# EAGLE design tides_v40 (EAGLE 9.7.0)

## Sheet 1 of 3
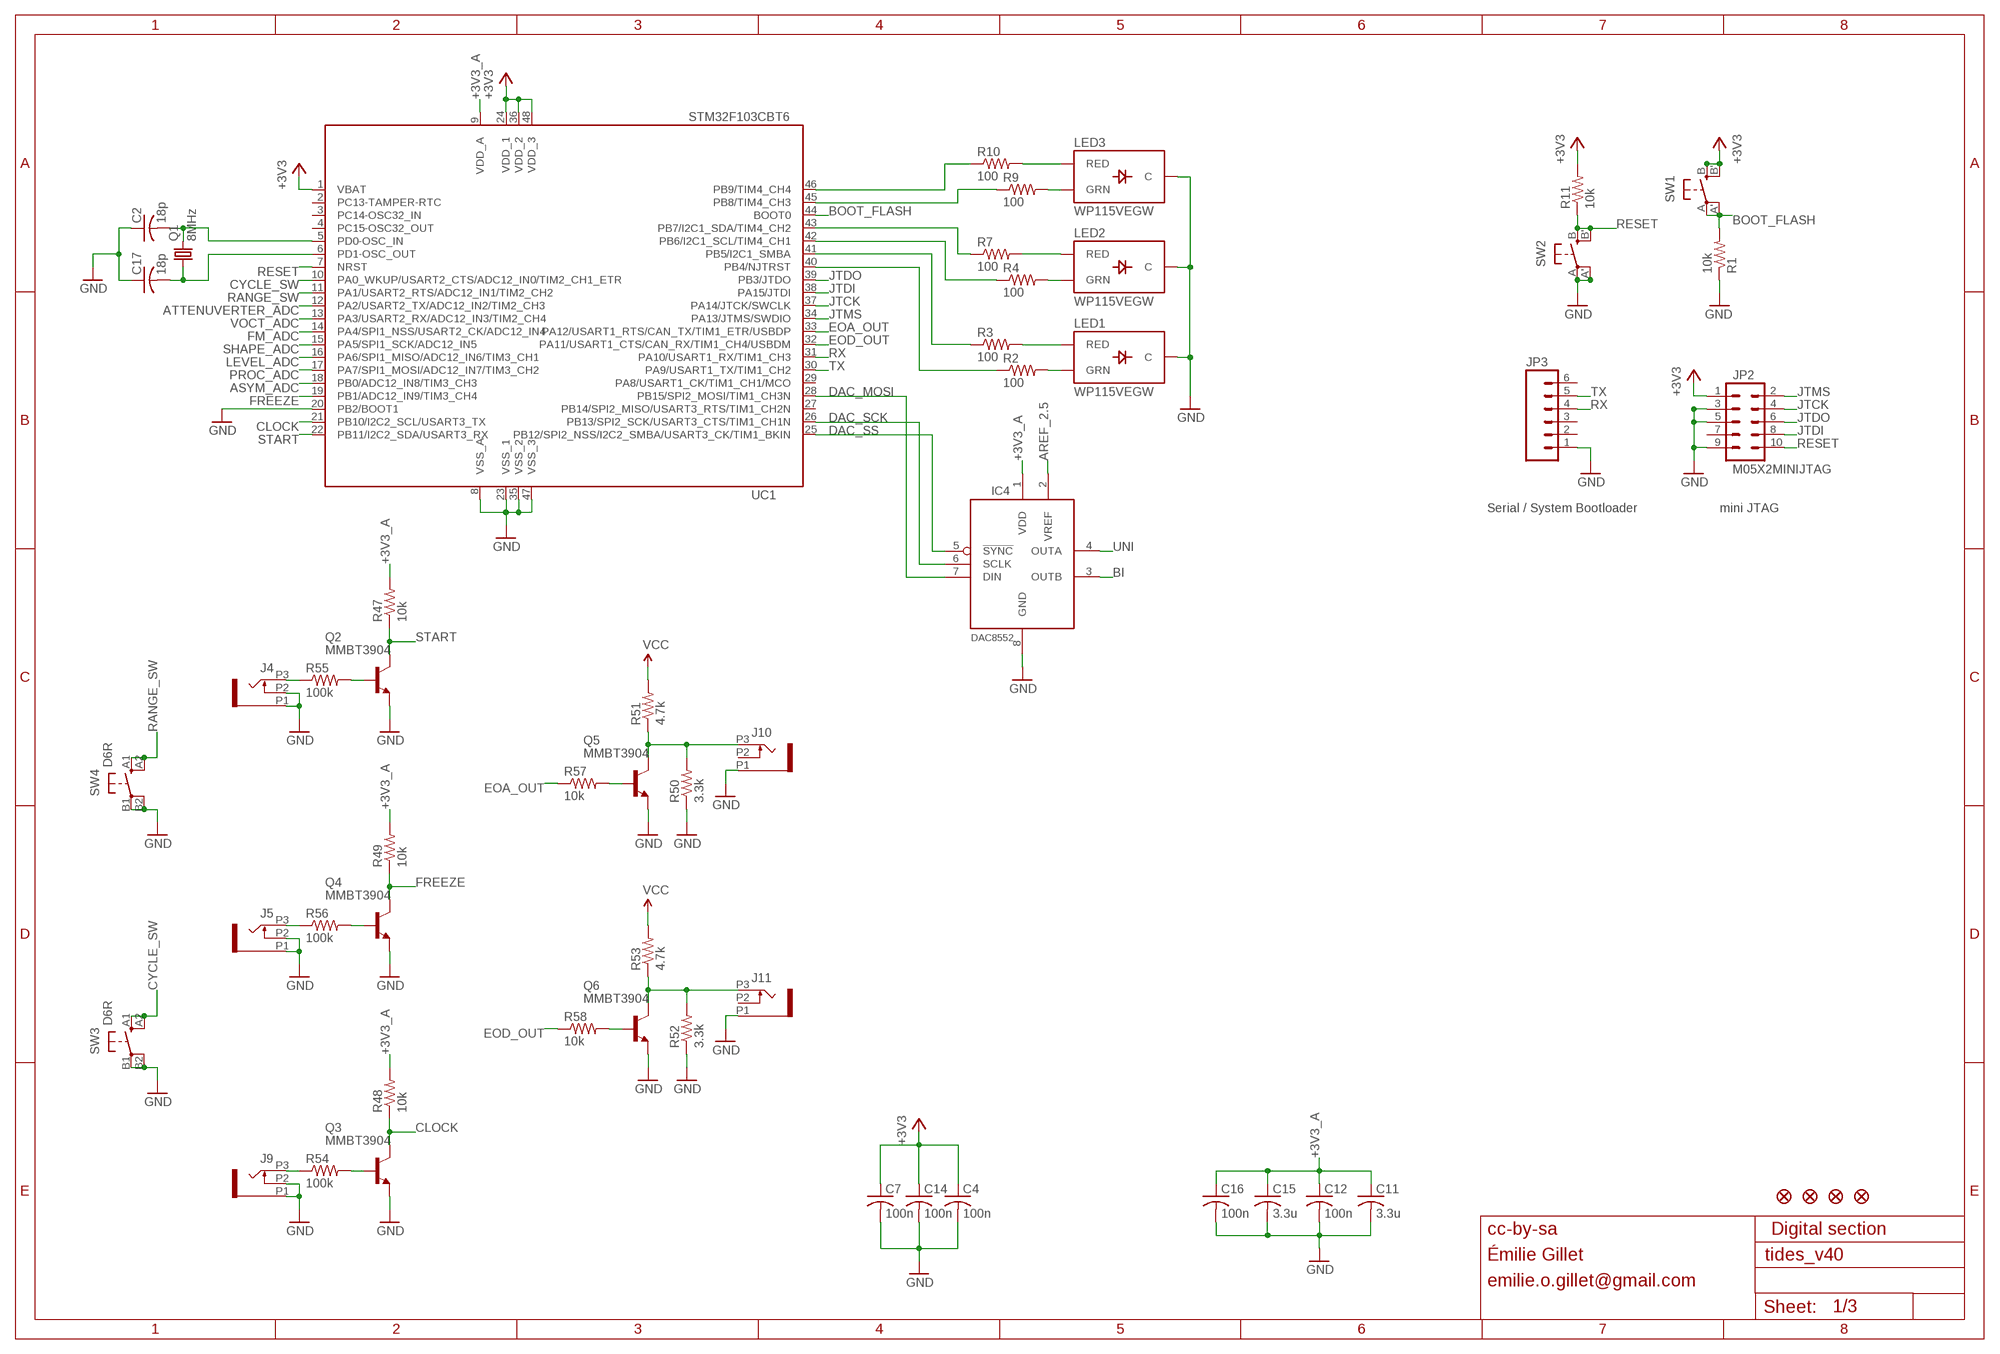
[diagram p0: schematic, sheet 1]

### Parts
C2  18p  C-USC0603  [C0603]
C4  100n  C-USC0603  [C0603]
C7  100n  C-USC0603  [C0603]
C11  3.3u  C-USC0603  [C0603]
C12  100n  C-USC0603  [C0603]
C14  100n  C-USC0603  [C0603]
C15  3.3u  C-USC0603  [C0603]
C16  100n  C-USC0603  [C0603]
C17  18p  C-USC0603  [C0603]
IC4  DAC8552  [MSOP-8]
J4  PJ301_THONKICONN6  [WQP_PJ_301M6]
J5  PJ301_THONKICONN6  [WQP_PJ_301M6]
J9  PJ301_THONKICONN6  [WQP_PJ_301M6]
J10  PJ301_THONKICONN6  [WQP_PJ_301M6]
J11  PJ301_THONKICONN6  [WQP_PJ_301M6]
JP2  M05X2MINIJTAG  [2X5-1.27]
JP3  M06SIP  [1X06]
JP4  FIDUCIAL1X2  [FIDUCIAL-1X2]
JP5  FIDUCIAL1X2  [FIDUCIAL-1X2]
JP6  FIDUCIAL1X2  [FIDUCIAL-1X2]
JP7  FIDUCIAL1X2  [FIDUCIAL-1X2]
LED1  WP115VEGW  LED-BICOLOR-THROUGHHOLE  [LED-BICOLOR-THROUGHHOLE]
LED2  WP115VEGW  LED-BICOLOR-THROUGHHOLE  [LED-BICOLOR-THROUGHHOLE]
LED3  WP115VEGW  LED-BICOLOR-THROUGHHOLE  [LED-BICOLOR-THROUGHHOLE]
Q1  8MHz  CRYSTALHC49UP  [HC49UP]
Q2  MMBT3904  MMBT3904LT1-NPN-SOT23-BEC  [SOT23-BEC]
Q3  MMBT3904  MMBT3904LT1-NPN-SOT23-BEC  [SOT23-BEC]
Q4  MMBT3904  MMBT3904LT1-NPN-SOT23-BEC  [SOT23-BEC]
Q5  MMBT3904  MMBT3904LT1-NPN-SOT23-BEC  [SOT23-BEC]
Q6  MMBT3904  MMBT3904LT1-NPN-SOT23-BEC  [SOT23-BEC]
R1  10k  R-US_R0603  [R0603]
R2  100  R-US_R0603  [R0603]
R3  100  R-US_R0603  [R0603]
R4  100  R-US_R0603  [R0603]
R7  100  R-US_R0603  [R0603]
R9  100  R-US_R0603  [R0603]
R10  100  R-US_R0603  [R0603]
R11  10k  R-US_R0603  [R0603]
R47  10k  R-US_R0603  [R0603]
R48  10k  R-US_R0603  [R0603]
R49  10k  R-US_R0603  [R0603]
R50  3.3k  R-US_R0603  [R0603]
R51  4.7k  R-US_R0603  [R0603]
R52  3.3k  R-US_R0603  [R0603]
R53  4.7k  R-US_R0603  [R0603]
R54  100k  R-US_R0603  [R0603]
R55  100k  R-US_R0603  [R0603]
R56  100k  R-US_R0603  [R0603]
R57  10k  R-US_R0603  [R0603]
R58  10k  R-US_R0603  [R0603]
SW1  EVQQ2  [EVQ-Q2]
SW2  EVQQ2  [EVQ-Q2]
SW3  D6R  [D6R]
SW4  D6R  [D6R]
UC1  STM32F103CBT6  STM32F103CB  [LQFP48]

### Nets
+3V3: C4.1 C7.1 C14.1 JP2.1 R11.2 SW1.B'(S1) SW1.B(S) UC1.1(VBAT) UC1.24(VDD_1) UC1.36(VDD_2) UC1.48(VDD_3) ; also sheet 3
+3V3_A: C11.1 C12.1 C15.1 C16.1 IC4.1(VDD) R47.2 R48.2 R49.2 UC1.9(VDD_A) ; also sheet 2,3
AREF_2.5: IC4.2(VREF) ; also sheet 3
ASYM_ADC: UC1.18(PB0/ADC12_IN8/TIM3_CH3) ; also sheet 2
ATTENUVERTER_ADC: UC1.12(PA2/USART2_TX/ADC12_IN2/TIM2_CH3) ; also sheet 2
BI: IC4.3(OUTB) ; also sheet 2
BOOT_FLASH: R1.2 SW1.A'(P1) SW1.A(P) UC1.44(BOOT0)
CLOCK: Q3.C R48.1 UC1.21(PB10/I2C2_SCL/USART3_TX)
CYCLE_SW: SW3.A1(S) SW3.A2(S1) UC1.10(PA0_WKUP/USART2_CTS/ADC12_IN0/TIM2_CH1_ETR)
DAC_MOSI: IC4.7(DIN) UC1.28(PB15/SPI2_MOSI/TIM1_CH3N)
DAC_SCK: IC4.6(SCLK) UC1.26(PB13/SPI2_SCK/USART3_CTS/TIM1_CH1N)
DAC_SS: IC4.5(!SYNC) UC1.25(PB12/SPI2_NSS/I2C2_SMBA/USART3_CK/TIM1_BKIN)
EOA_OUT: R57.1 UC1.33(PA12/USART1_RTS/CAN_TX/TIM1_ETR/USBDP)
EOD_OUT: R58.1 UC1.32(PA11/USART1_CTS/CAN_RX/TIM1_CH4/USBDM)
FM_ADC: UC1.14(PA4/SPI1_NSS/USART2_CK/ADC12_IN4) ; also sheet 2
FREEZE: Q4.C R49.1 UC1.19(PB1/ADC12_IN9/TIM3_CH4)
GND: C2.1 C4.2 C7.2 C11.2 C12.2 C14.2 C15.2 C16.2 C17.1 IC4.8(GND) J4.P1 J4.P2 J5.P1 J5.P2 J9.P1 J9.P2 J10.P1 J11.P1 JP2.3 JP2.5 JP2.9 JP3.1 LED1.2(C) LED2.2(C) LED3.2(C) Q2.E Q3.E Q4.E Q5.E Q6.E R1.1 R50.1 R52.1 SW2.A'(P1) SW2.A(P) SW3.B1(P) SW3.B2(P1) SW4.B1(P) SW4.B2(P1) UC1.8(VSS_A) UC1.20(PB2/BOOT1) UC1.23(VSS_1) UC1.35(VSS_2) UC1.47(VSS_3) ; also sheet 2,3
JTCK: JP2.4 UC1.37(PA14/JTCK/SWCLK)
JTDI: JP2.8 UC1.38(PA15/JTDI)
JTDO: JP2.6 UC1.39(PB3/JTDO)
JTMS: JP2.2 UC1.34(PA13/JTMS/SWDIO)
LEVEL_ADC: UC1.16(PA6/SPI1_MISO/ADC12_IN6/TIM3_CH1) ; also sheet 2
N$7: C2.2 Q1.2 UC1.5(PD0-OSC_IN)
N$8: C17.2 Q1.1 UC1.6(PD1-OSC_OUT)
N$21: J5.P3 R56.1
N$23: Q4.B R56.2
N$24: J9.P3 R54.1
N$25: Q3.B R54.2
N$26: Q6.B R58.2
N$27: J11.P3 Q6.C R52.2 R53.1
N$28: LED3.3(RED) R10.2
N$29: LED3.1(GRN) R9.2
N$30: LED2.3(RED) R7.2
N$31: LED2.1(GRN) R4.2
N$32: LED1.3(RED) R3.2
N$33: LED1.1(GRN) R2.2
N$34: R10.1 UC1.46(PB9/TIM4_CH4)
N$35: R9.1 UC1.45(PB8/TIM4_CH3)
N$36: R7.1 UC1.43(PB7/I2C1_SDA/TIM4_CH2)
N$37: R4.1 UC1.42(PB6/I2C1_SCL/TIM4_CH1)
N$38: R3.1 UC1.41(PB5/I2C1_SMBA)
N$39: R2.1 UC1.40(PB4/NJTRST)
N$44: J10.P3 Q5.C R50.2 R51.1
N$47: Q5.B R57.2
N$57: J4.P3 R55.1
N$66: Q2.B R55.2
PROC_ADC: UC1.17(PA7/SPI1_MOSI/ADC12_IN7/TIM3_CH2) ; also sheet 2
RANGE_SW: SW4.A1(S) SW4.A2(S1) UC1.11(PA1/USART2_RTS/ADC12_IN1/TIM2_CH2)
RESET: JP2.10 R11.1 SW2.B'(S1) SW2.B(S) UC1.7(NRST)
RX: JP3.4 UC1.31(PA10/USART1_RX/TIM1_CH3)
SHAPE_ADC: UC1.15(PA5/SPI1_SCK/ADC12_IN5) ; also sheet 2
START: Q2.C R47.1 UC1.22(PB11/I2C2_SDA/USART3_RX)
TX: JP3.5 UC1.30(PA9/USART1_TX/TIM1_CH2)
UNI: IC4.4(OUTA) ; also sheet 2
VCC: R51.2 R53.2 ; also sheet 2,3
VOCT_ADC: UC1.13(PA3/USART2_RX/ADC12_IN3/TIM2_CH4) ; also sheet 2
Unconnected: J10.P2 J11.P2 JP2.7 JP3.2 JP3.3 JP3.6 UC1.2(PC13-TAMPER-RTC) UC1.3(PC14-OSC32_IN) UC1.4(PC15-OSC32_OUT) UC1.27(PB14/SPI2_MISO/USART3_RTS/TIM1_CH2N) UC1.29(PA8/USART1_CK/TIM1_CH1/MCO)

### Notes on the sheet
- Serial / System Bootloader | mini JTAG
- cc-by-sa | Digital section
- Émilie Gillet
- emilie.o.gillet@gmail.com

## Sheet 2 of 3
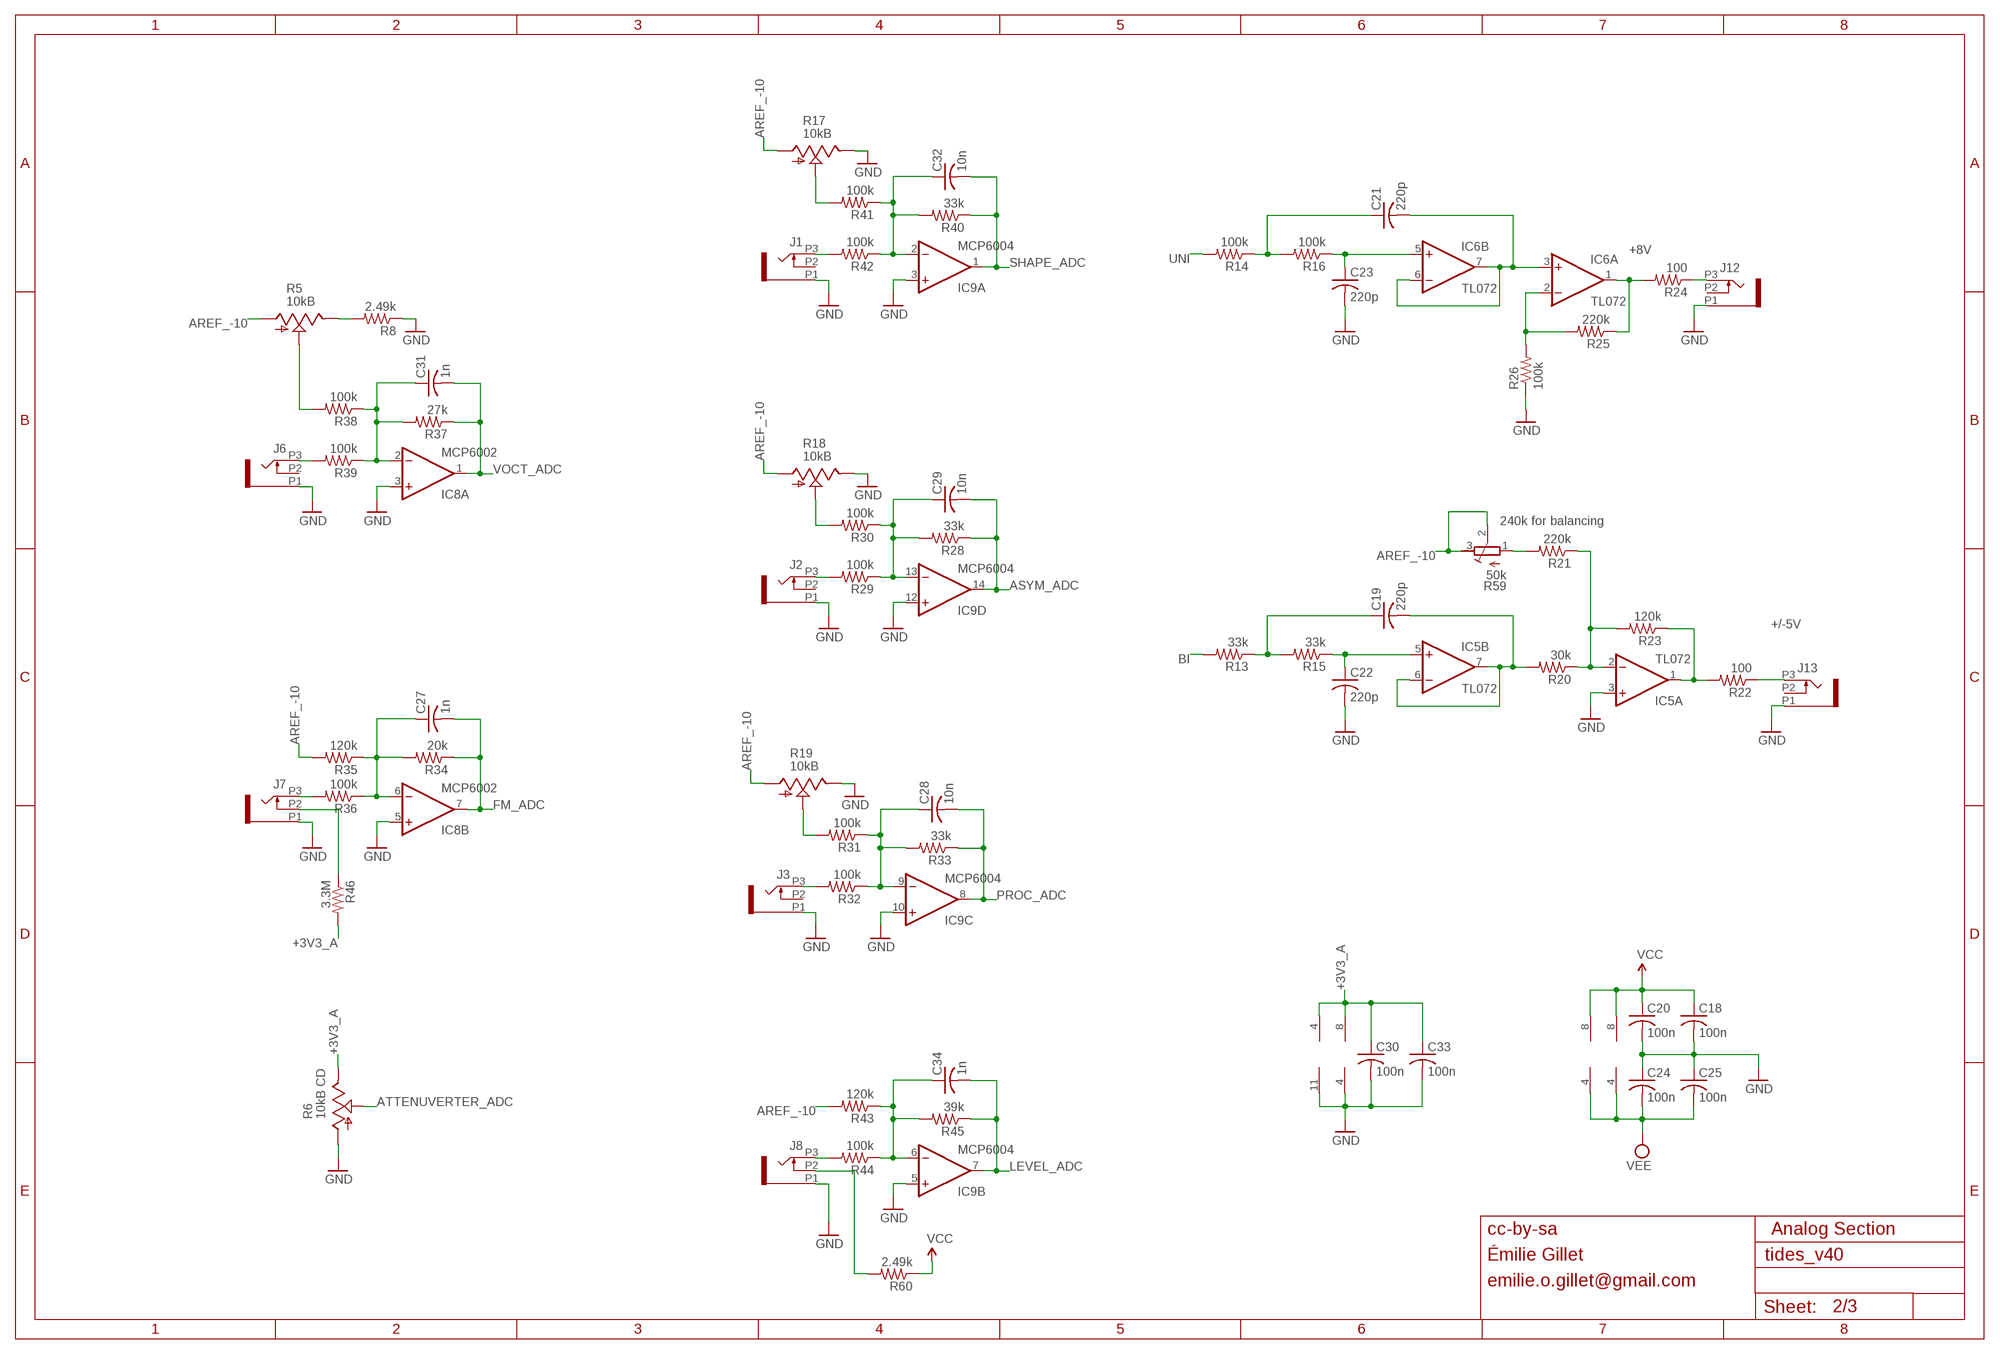
[diagram p1: schematic, sheet 2]

### Parts
C18  100n  C-USC0603  [C0603]
C19  220p  C-USC0603  [C0603]
C20  100n  C-USC0603  [C0603]
C21  220p  C-USC0603  [C0603]
C22  220p  C-USC0603  [C0603]
C23  220p  C-USC0603  [C0603]
C24  100n  C-USC0603  [C0603]
C25  100n  C-USC0603  [C0603]
C27  1n  C-USC0603  [C0603]
C28  10n  C-USC0603  [C0603]
C29  10n  C-USC0603  [C0603]
C30  100n  C-USC0603  [C0603]
C31  1n  C-USC0603  [C0603]
C32  10n  C-USC0603  [C0603]
C33  100n  C-USC0603  [C0603]
C34  1n  C-USC0603  [C0603]
IC5  TL072  TL072D  [SO08]
IC6  TL072  TL072D  [SO08]
IC8  MCP6002  TL072D  [SO08]
IC9  MCP6004  TL074D  [SO14]
J1  PJ301_THONKICONN6  [WQP_PJ_301M6]
J2  PJ301_THONKICONN6  [WQP_PJ_301M6]
J3  PJ301_THONKICONN6  [WQP_PJ_301M6]
J6  PJ301_THONKICONN6  [WQP_PJ_301M6]
J7  PJ301_THONKICONN6  [WQP_PJ_301M6]
J8  PJ301_THONKICONN6  [WQP_PJ_301M6]
J12  PJ301_THONKICONN6  [WQP_PJ_301M6]
J13  PJ301_THONKICONN6  [WQP_PJ_301M6]
R5  10kB  POT_USVERTICAL_PS  [ALPS_POT_VERTICAL_PS]
R6  10kB CD  POT_USVERTICAL_PS  [ALPS_POT_VERTICAL_PS]
R8  2.49k  R-US_R0603  [R0603]
R13  33k  R-US_R0603  [R0603]
R14  100k  R-US_R0603  [R0603]
R15  33k  R-US_R0603  [R0603]
R16  100k  R-US_R0603  [R0603]
R17  10kB  POT_USVERTICAL_PS  [ALPS_POT_VERTICAL_PS]
R18  10kB  POT_USVERTICAL_PS  [ALPS_POT_VERTICAL_PS]
R19  10kB  POT_USVERTICAL_PS  [ALPS_POT_VERTICAL_PS]
R20  30k  R-US_R0603  [R0603]
R21  220k  R-US_R0603  [R0603]
R22  100  R-US_R0603  [R0603]
R23  120k  R-US_R0603  [R0603]
R24  100  R-US_R0603  [R0603]
R25  220k  R-US_R0603  [R0603]
R26  100k  R-US_R0603  [R0603]
R28  33k  R-US_R0603  [R0603]
R29  100k  R-US_R0603  [R0603]
R30  100k  R-US_R0603  [R0603]
R31  100k  R-US_R0603  [R0603]
R32  100k  R-US_R0603  [R0603]
R33  33k  R-US_R0603  [R0603]
R34  20k  R-US_R0603  [R0603]
R35  120k  R-US_R0603  [R0603]
R36  100k  R-US_R0603  [R0603]
R37  27k  R-US_R0603  [R0603]
R38  100k  R-US_R0603  [R0603]
R39  100k  R-US_R0603  [R0603]
R40  33k  R-US_R0603  [R0603]
R41  100k  R-US_R0603  [R0603]
R42  100k  R-US_R0603  [R0603]
R43  120k  R-US_R0603  [R0603]
R44  100k  R-US_R0603  [R0603]
R45  39k  R-US_R0603  [R0603]
R46  3.3M  R-US_R0603  [R0603]
R59  50k  R-TRIMM3296X  [RTRIM3296X]
R60  2.49k  R-US_R0805  [R0805]

### Nets
+3V3_A: C30.1 C33.1 IC8.8(P:V+) IC9.4(P:V+) R6.P$1(E) R46.2 ; also sheet 1,3
AREF_-10: R5.P$3(A) R17.P$3(A) R18.P$3(A) R19.P$3(A) R35.2 R43.2 R59.2(S) R59.3(A) ; also sheet 3
ASYM_ADC: C29.2 IC9.14(D:OUT) R28.1 ; also sheet 1
ATTENUVERTER_ADC: R6.P$2(S) ; also sheet 1
BI: R13.2 ; also sheet 1
BI_OUT: IC5.1(A:OUT) R22.2 R23.1
F_CV: IC5.2(A:-IN) R20.1 R21.1 R23.2
FM_ADC: C27.2 IC8.7(B:OUT) R34.1 ; also sheet 1
GND: C18.2 C20.2 C22.2 C23.2 C24.1 C25.1 C30.2 C33.2 IC5.3(A:+IN) IC8.3(A:+IN) IC8.4(P:V-) IC8.5(B:+IN) IC9.3(A:+IN) IC9.5(B:+IN) IC9.10(C:+IN) IC9.11(P:V-) IC9.12(D:+IN) J1.P1 J2.P1 J3.P1 J6.P1 J7.P1 J8.P1 J12.P1 J13.P1 R6.P$3(A) R8.1 R17.P$1(E) R18.P$1(E) R19.P$1(E) R26.1 ; also sheet 1,3
LEVEL_ADC: C34.2 IC9.7(B:OUT) R45.1 ; also sheet 1
N$1: J1.P3 R42.2
N$2: C32.1 IC9.2(A:-IN) R40.2 R41.1 R42.1
N$3: R17.P$2(S) R41.2
N$4: J2.P3 R29.2
N$5: C29.1 IC9.13(D:-IN) R28.2 R29.1 R30.1
N$6: J7.P2 R46.1
N$9: R18.P$2(S) R30.2
N$10: J3.P3 R32.2
N$11: C28.1 IC9.9(C:-IN) R31.1 R32.1 R33.2
N$12: R19.P$2(S) R31.2
N$13: J8.P3 R44.2
N$14: C34.1 IC9.6(B:-IN) R43.1 R44.1 R45.2
N$15: J6.P3 R39.2
N$16: C31.1 IC8.2(A:-IN) R37.2 R38.1 R39.1
N$17: R5.P$2(S) R38.2
N$18: J13.P3 R22.1
N$19: R5.P$1(E) R8.2
N$20: J7.P3 R36.2
N$22: C27.1 IC8.6(B:-IN) R34.2 R35.1 R36.1
N$40: R21.2 R59.1(E)
N$41: IC6.2(A:-IN) R25.2 R26.2
N$42: C19.2 IC5.6(B:-IN) IC5.7(B:OUT) R20.2
N$43: C22.1 IC5.5(B:+IN) R15.1
N$45: C19.1 R13.1 R15.2
N$46: IC6.1(A:OUT) R24.2 R25.1
N$48: J8.P2 R60.2
N$67: C21.2 IC6.3(A:+IN) IC6.6(B:-IN) IC6.7(B:OUT)
N$69: C23.1 IC6.5(B:+IN) R16.1
N$71: C21.1 R14.1 R16.2
PROC_ADC: C28.2 IC9.8(C:OUT) R33.1 ; also sheet 1
SHAPE_ADC: C32.2 IC9.1(A:OUT) R40.1 ; also sheet 1
UNI: R14.2 ; also sheet 1
UNI_OUT: J12.P3 R24.1
VCC: C18.1 C20.1 IC5.8(P:V+) IC6.8(P:V+) R60.1 ; also sheet 1,3
VEE: C24.2 C25.2 IC5.4(P:V-) IC6.4(P:V-) ; also sheet 3
VOCT_ADC: C31.2 IC8.1(A:OUT) R37.1 ; also sheet 1
Unconnected: J1.P2 J2.P2 J3.P2 J6.P2 J12.P2 J13.P2

### Notes on the sheet
- +8V
- 240k for balancing
- +/-5V
- cc-by-sa | Analog Section
- Émilie Gillet
- emilie.o.gillet@gmail.com

## Sheet 3 of 3
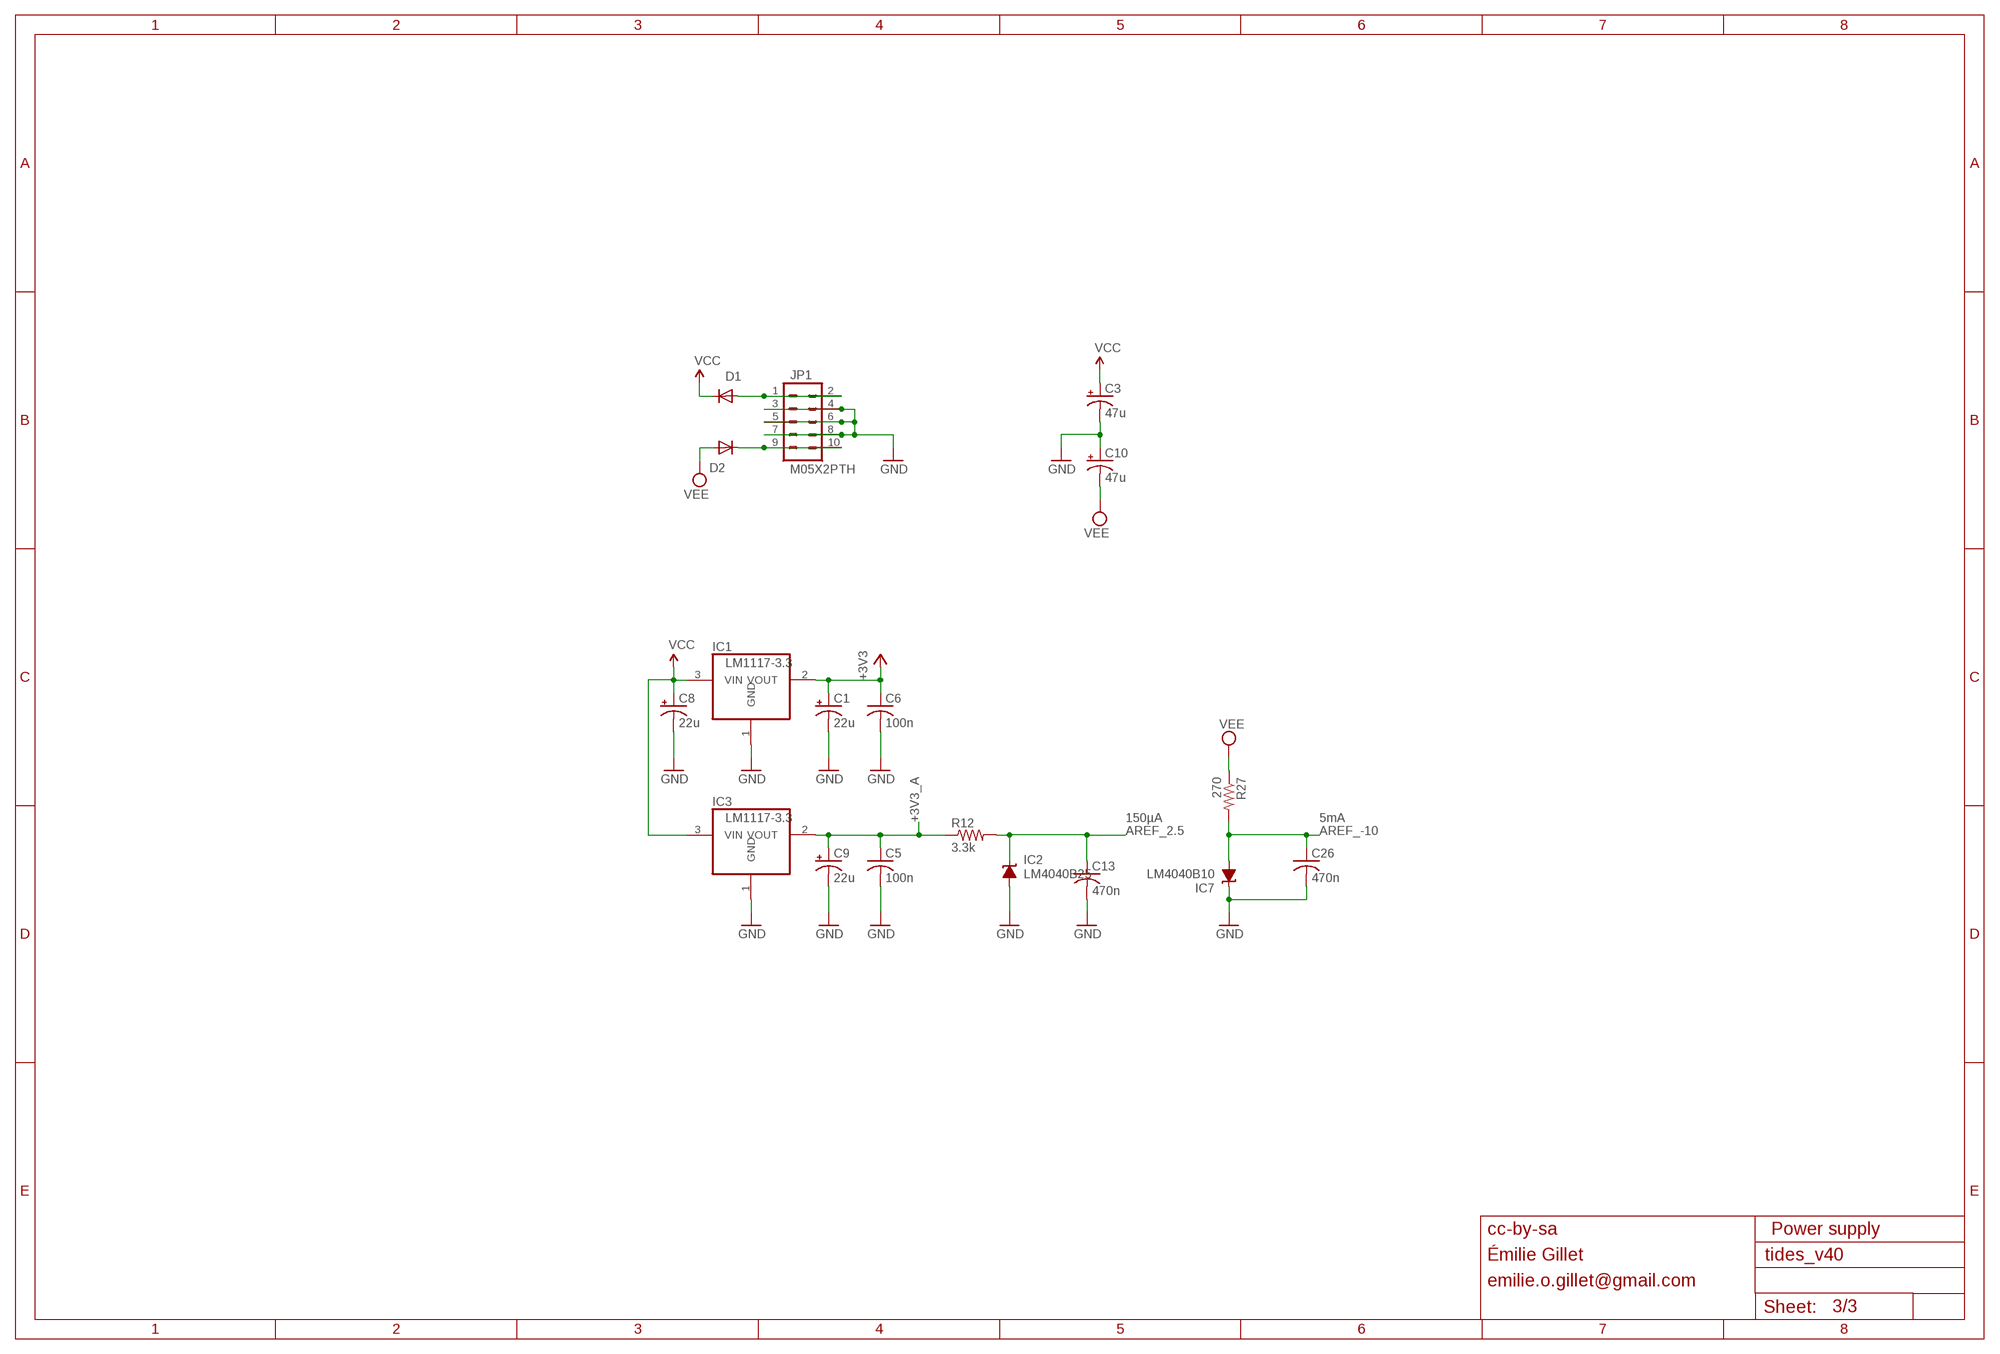
[diagram p2: schematic, sheet 3]

### Parts
C1  22u  CPOL-USC  [PANASONIC_C]
C3  47u  CPOL-USD  [PANASONIC_D]
C5  100n  C-USC0603  [C0603]
C6  100n  C-USC0603  [C0603]
C8  22u  CPOL-USC  [PANASONIC_C]
C9  22u  CPOL-USC  [PANASONIC_C]
C10  47u  CPOL-USD  [PANASONIC_D]
C13  470n  C-USC0603  [C0603]
C26  470n  C-USC0603  [C0603]
D1  1N5819HW  DIODE-SOD123  [SOD123]
D2  1N5819HW  DIODE-SOD123  [SOD123]
IC1  LM1117-3.3  REG1117  [SOT223]
IC2  LM4040B25  LM4041B12DBZ  [DBZ_R-PDSO-G3]
IC3  LM1117-3.3  REG1117  [SOT223]
IC7  LM4040B10  LM4041B12DBZ  [DBZ_R-PDSO-G3]
JP1  M05X2PTH  [AVR_ICSP]
R12  3.3k  R-US_R0603  [R0603]
R27  270  R-US_R0603  [R0603]

### Nets
+3V3: C1.+ C6.1 IC1.2(VOUT) ; also sheet 1
+3V3_A: C5.1 C9.+ IC3.2(VOUT) R12.1 ; also sheet 1,2
AREF_2.5: C13.1 IC2.1(C) R12.2 ; also sheet 1
AREF_-10: C26.1 IC7.2(A) R27.2 ; also sheet 2
GND: C1.- C3.- C5.2 C6.2 C8.- C9.- C10.+ C13.2 C26.2 IC1.1(GND) IC2.2(A) IC3.1(GND) IC7.1(C) JP1.3 JP1.4 JP1.5 JP1.6 JP1.7 JP1.8 ; also sheet 1,2
N$56: D1.A JP1.1 JP1.2
N$64: D2.C JP1.9 JP1.10
VCC: C3.+ C8.+ D1.C IC1.3(VIN) IC3.3(VIN) ; also sheet 1,2
VEE: C10.- D2.A R27.1 ; also sheet 2

### Notes on the sheet
- 150µA | 5mA
- cc-by-sa | Power supply
- Émilie Gillet
- emilie.o.gillet@gmail.com

## Library data of the parts
C1 C3 C8-C10 = rcl:CPOL-US: POLARIZED CAPACITOR, American symbol
C2 C4-C7 C11-C34 = rcl:C-US: CAPACITOR, American symbol
D1 D2 = diode:DIODE-: DIODE
IC1 IC3 = og-vreg:REG1117: 800mA and 1A Low Dropout (LDO) Positive Regulator 1.8V, 2.5V, 2.85V, 3.3V, 5V, and Adj
IC2 IC7 = texas:LM4041: PRECISION MICROPOWER SHUNT VOLTAGE REFERENCE Source: http://focus.ti.com/lit/ds/slcs146e/slcs146e.pdf
IC4 = og-dac:DAC8552
IC5 IC6 IC8 = linear:TL072: OP AMP
IC9 = gm-ics:TL074: OP AMP
J1-J13 = og-pj301_variations:PJ301_THONKICONN
JP1 JP2 = og-header:M05X2: Header 5x2 Standard 10-pin dual row 0.1" header. Commonly used with AVR-ISP. Use with Spark Fun Electronics SKU: PRT-00778
JP3 = SparkFun:M06: Header 6 Standard 6-pin 0.1" header. Use with straight break away headers (SKU : PRT-00116), right angle break away headers (PRT-00553), swiss pins (PRT-00743), machine pins (PRT-00117), and female headers (PRT-00115). Molex polarized connector foot print use with SKU : PRT-08094 with associated crimp pins and housings. NOTES ON THE VARIANTS LOCK and LOCK_LONGPADS... This footprint was designed to help hold the alignment of a through-hole component (i.e. 6-pin header) while soldering it into place. You may notice that each hole has been shifted either up or down by 0.005 of an inch from it's more standard position (which is a perfectly straight line). This slight alteration caused the pins (the squares in the middle) to touch the edges of the holes. Because they are alternating, it causes a "brace" to hold the component in place. 0.005 has proven to be the perfect amount of "off-center" position when using our standard breakaway headers. Although looks a little odd when you look at the bare footprint, once you have a header in there, the alteration is very hard to notice. Also, if you push a header all the way into place, it is covered up entirely on the bottom side. This idea of altering the position of holes to aid alignment will be further integrated into the Sparkfun Library for other footprints. It can help hold any component with 3 or more connection pins.
JP4-JP7 = SparkFun:FIDUCIAL: Fiducial Alignment Points Various fiducial points for machine vision alignment.
LED1-LED3 = og-leds:LED-BICOLOR-THROUGHHOLE
Q1 = crystal:CRYSTAL: CRYSTAL
Q2-Q6 = transistor:*-NPN-: NPN Transistror BF959 corrected 2008.03.06
R1-R4 R7-R16 R20-R58 R60 = rcl:R-US_: RESISTOR, American symbol
R5 R6 R17-R19 = pot-alps:POT_US
R59 = rcl:R-TRIMM: Trimm resistor
SW1 SW2 = adafruit:EVQQ2: SMT 6mm switch, EVQQ2 series http://www.ladyada.net/library/eagle
SW3 SW4 = og-switch:D6R: C&K D6R
UC1 = stm32:STM32F103CB

## Board
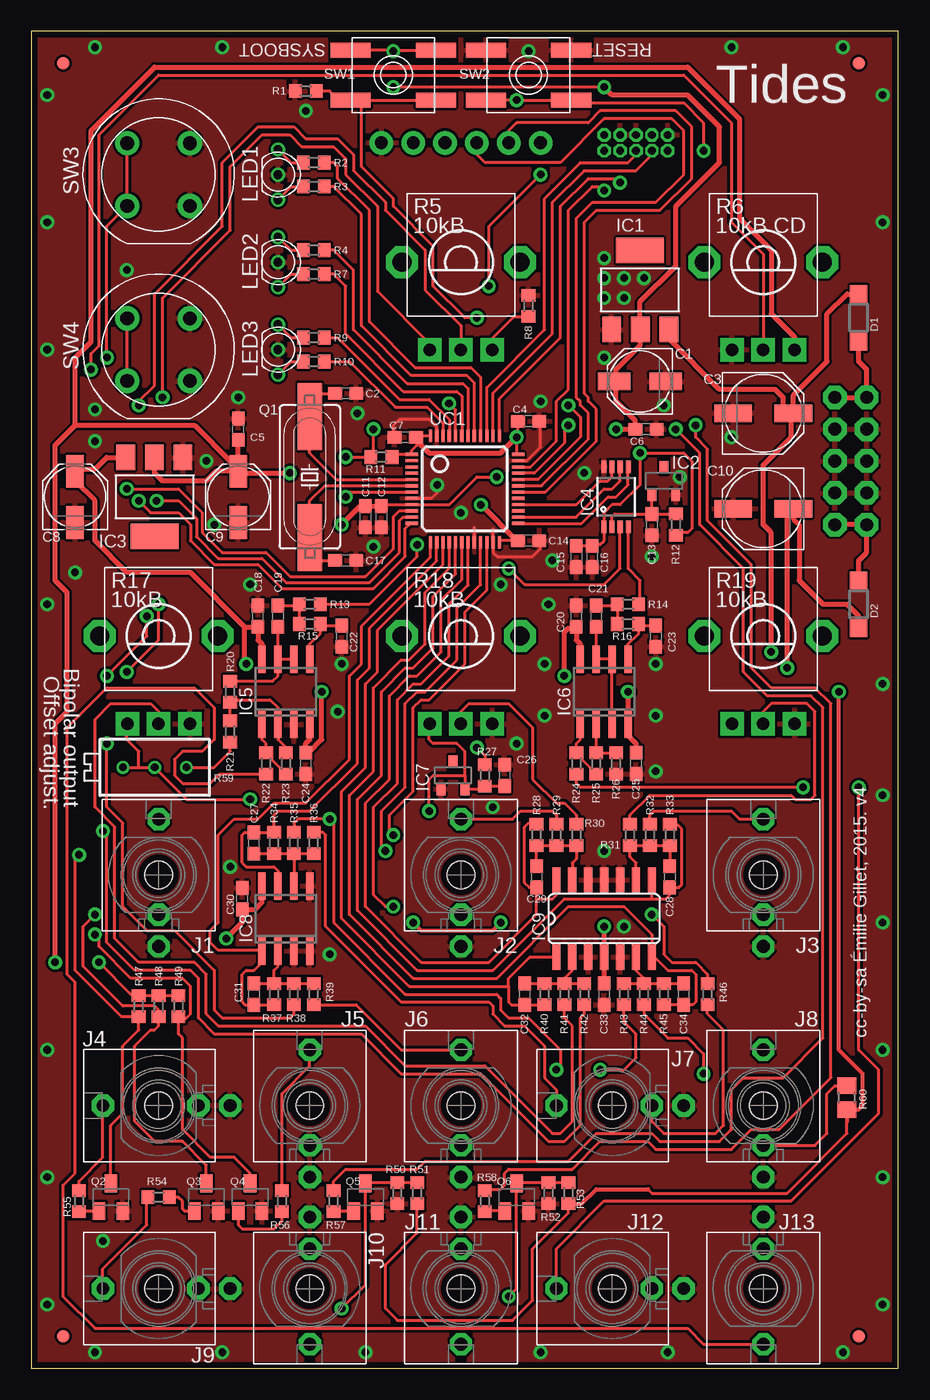
[diagram p3: board, top side]
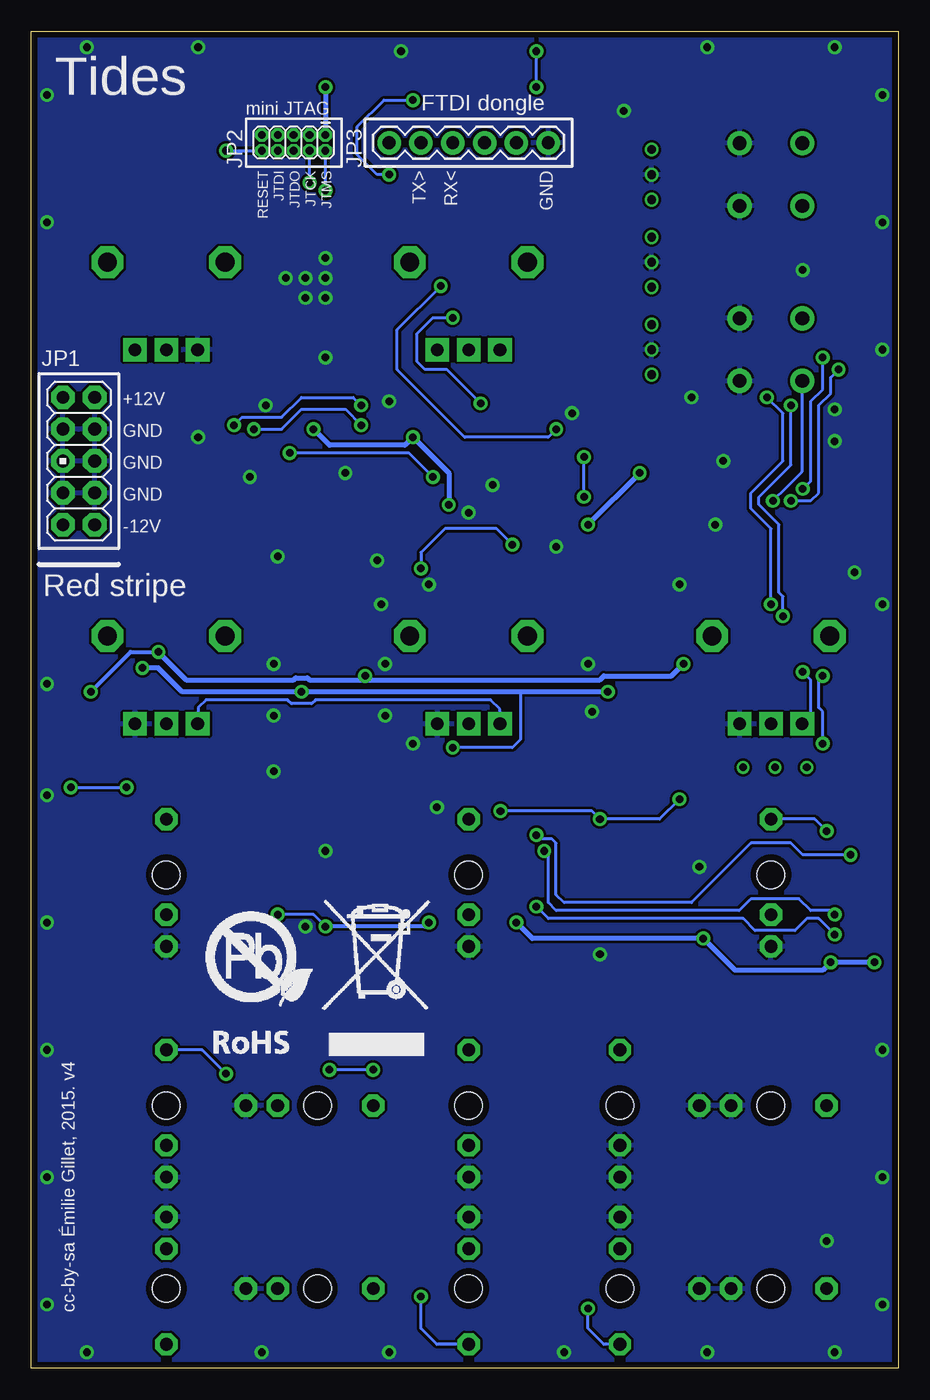
[diagram p4: board, bottom side, seen from below]

Size 69.19 x 106.68 mm. Coordinates in mm from the lower left corner, seen from the top.
Outline: 0,0 69.19,0 69.19,106.68 0,106.68 0,0
Copper layers (1*16): Top 0.035mm / dielectric 1.5mm / Bottom 0.035mm
Design rules "PCBCart-Standard": minimum track width 8mil, minimum drill 0.4mm, track to track 8mil, track to pad 8mil, pad to pad 8mil, via to via 8mil, smd to smd 8mil, copper to edge 20mil, drill to drill 8mil, minimum pad ring 8mil, minimum via ring 10mil, stop-mask expansion 3mil, vias tented up to drill 25mil, thermal gap 8mil

### Footprints (pad centres in the part's own frame; a part is rotated, then mirrored left to right if it is on the bottom)
PANASONIC_C = smd 2.6 x 1.4: + 2.05,0; - -2.05,0
C0603 = smd 1.1 x 1: 1 -0.85,0; 2 0.85,0
PANASONIC_D = smd 3 x 1.4: + 2.4,0; - -2.4,0
SOD123 = smd 1.4 x 1.4: A 1.9,0; C -1.9,0
SOT223 = smd 1.499 x 2.007: 1 -2.261,-3.15; 2 0.025,-3.15; 3 2.311,-3.15 | smd 3.81 x 2.007: 4 0,3.15
DBZ_R-PDSO-G3 = smd 0.7 x 1: 1 -0.95,-1.1; 2 0.95,-1.1; 3 0,1.1
MSOP-8 = smd 0.41 x 1.02: 1 -0.975,-2.4; 2 -0.325,-2.4; 3 0.325,-2.4; 4 0.975,-2.4; 5 0.975,2.4; 6 0.325,2.4; 7 -0.325,2.4; 8 -0.975,2.4
SO08 = smd 0.6 x 2.2: 1 -1.905,-2.6; 2 -0.635,-2.6; 3 0.635,-2.6; 4 1.905,-2.6; 5 1.905,2.6; 6 0.635,2.6; 7 -0.635,2.6; 8 -1.905,2.6
SO14 = smd 0.66 x 2.032: 1 -3.81,-3.073; 2 -2.54,-3.073; 3 -1.27,-3.073; 4 0,-3.073; 5 1.27,-3.073; 6 2.54,-3.073; 7 3.81,-3.073; 8 3.81,3.073; 9 2.54,3.073; 10 1.27,3.073; 11 0,3.073; 12 -1.27,3.073; 13 -2.54,3.073; 14 -3.81,3.073
WQP_PJ_301M6 = drill 1.016 pad 1.778 octagon: P1 0,-5.715; P2 0,-3.175; P3 0,4.445 | hole 2.2: 0,0
AVR_ICSP = drill 1.016 pad 1.88 octagon: 1 -1.27,5.08; 2 1.27,5.08; 3 -1.27,2.54; 4 1.27,2.54; 5 -1.27,0; 6 1.27,0; 7 -1.27,-2.54; 8 1.27,-2.54; 9 -1.27,-5.08; 10 1.27,-5.08
2X5-1.27 = drill 0.61 pad 1.067 octagon: 1 -1.27,3.81; 2 0,3.81; 3 -1.27,2.54; 4 0,2.54; 5 -1.27,1.27; 6 0,1.27; 7 -1.27,0; 8 0,0; 9 -1.27,-1.27; 10 0,-1.27
1X06 = drill 1.016 pad 1.88: 1 0,0; 2 2.54,0; 3 5.08,0; 4 7.62,0; 5 10.16,0; 6 12.7,0
FIDUCIAL-1X2 = smd 1 x 1: 1 0,0
LED-BICOLOR-THROUGHHOLE = drill 0.7: 1 -2,0; 2 0,0; 3 2,0
HC49UP = smd 5.334 x 1.93: 1 -4.826,0; 2 4.826,0
SOT23-BEC = smd 1 x 1.4: B -0.95,-1.1; C 0,1.1; E 0.95,-1.1
R0603 = smd 1 x 1.1: 1 -0.85,0; 2 0.85,0
ALPS_POT_VERTICAL_PS = drill 1 pad 1.88 square: P$1 -2.5,7; P$2 0,7; P$3 2.5,7 | drill 1.5 pad 2.54 octagon: P$4 -4.7,0; P$5 4.7,0
RTRIM3296X = drill 0.61: 1 0,-2.54; 2 0,0; 3 0,2.54
R0805 = smd 1.3 x 1.5: 1 -0.95,0; 2 0.95,0
EVQ-Q2 = smd 3.2 x 1.2: A -3.4,-2; A' 3.4,-2; B -3.4,2; B' 3.4,2
D6R = drill 1.1 pad 1.93: A1 -2.5,2.5; A2 2.5,2.5; B1 -2.5,-2.5; B2 2.5,-2.5
LQFP48 = smd 0.254 x 1: 1 -2.75,-4.25; 2 -2.25,-4.25; 3 -1.75,-4.25; 4 -1.25,-4.25; 5 -0.75,-4.25; 6 -0.25,-4.25; 7 0.25,-4.25; 8 0.75,-4.25; 9 1.25,-4.25; 10 1.75,-4.25; 11 2.25,-4.25; 12 2.75,-4.25; 25 2.75,4.25; 26 2.25,4.25; 27 1.75,4.25; 28 1.25,4.25; 29 0.75,4.25; 30 0.25,4.25; 31 -0.25,4.25; 32 -0.75,4.25; 33 -1.25,4.25; 34 -1.75,4.25; 35 -2.25,4.25; 36 -2.75,4.25 | smd 1 x 0.254: 13 4.25,-2.75; 14 4.25,-2.25; 15 4.25,-1.75; 16 4.25,-1.25; 17 4.25,-0.75; 18 4.25,-0.25; 19 4.25,0.25; 20 4.25,0.75; 21 4.25,1.25; 22 4.25,1.75; 23 4.25,2.25; 24 4.25,2.75; 37 -4.25,2.75; 38 -4.25,2.25; 39 -4.25,1.75; 40 -4.25,1.25; 41 -4.25,0.75; 42 -4.25,0.25; 43 -4.25,-0.25; 44 -4.25,-0.75; 45 -4.25,-1.25; 46 -4.25,-1.75; 47 -4.25,-2.25; 48 -4.25,-2.75

### Placement (x,y rotation side)
C1  48.58,78.74 180 top
C2  25.08,77.79 180 top
C3  58.42,76.2 0 top
C4  39.69,75.56 0 top
C5  16.51,74.93 90 top
C6  49.05,74.93 0 top
C7  29.84,74.3 180 top
C8  3.49,69.53 90 top
C9  16.51,69.53 90 top
C10  58.42,68.58 180 top
C11  26.67,67.94 270 top
C12  27.94,67.94 270 top
C13  49.53,67.31 270 top
C14  39.69,66.04 0 top
C15  43.5,64.77 270 top
C16  44.77,64.77 270 top
C17  25.08,64.45 180 top
C18  18.1,60.01 90 top
C19  19.68,60.01 270 top
C20  43.5,60.01 90 top
C21  45.09,60.01 270 top
C22  24.77,58.42 270 top
C23  49.85,58.42 270 top
C24  21.91,48.26 90 top
C25  48.26,48.26 90 top
C26  37.78,47.31 90 top
C27  17.78,41.91 90 top
C28  50.96,39.21 270 top
C29  40.32,39.21 270 top
C30  16.83,37.47 90 top
C31  17.78,29.84 270 top
C32  39.37,29.84 270 top
C33  45.72,29.84 270 top
C34  52.07,29.84 270 top
D1  66.04,83.82 270 top
D2  66.04,60.96 270 top
IC1  48.58,86.04 0 top
IC2  50.48,70.8 0 top
IC3  9.84,69.53 180 top
IC4  46.67,69.53 0 top
IC5  20.32,53.98 0 top
IC6  45.72,53.98 0 top
IC7  33.66,47.31 0 top
IC8  20.32,35.88 0 top
IC9  45.72,35.88 0 top
J1  10.16,39.37 0 top
J2  34.29,39.37 0 top
J3  58.42,39.37 0 top
J4  10.16,20.95 90 top
J5  22.23,20.95 0 top
J6  34.29,20.95 0 top
J7  46.35,20.95 90 top
J8  58.42,20.95 0 top
J9  10.16,6.35 90 top
J10  22.23,6.35 180 top
J11  34.29,6.35 180 top
J12  46.35,6.35 90 top
J13  58.42,6.35 180 top
JP1  65.41,72.39 0 bottom
JP2  49.53,97.16 270 bottom
JP3  27.94,97.79 180 bottom
JP4  2.54,104.14 0 top
JP5  66.04,104.14 0 top
JP6  2.54,2.54 0 top
JP7  66.04,2.54 0 top
LED1  19.68,95.25 270 top
LED2  19.68,88.27 270 top
LED3  19.68,81.28 270 top
Q1  22.23,71.12 90 top
Q2  6.35,13.65 0 top
Q3  13.97,13.65 0 top
Q4  17.46,13.65 0 top
Q5  26.67,13.65 0 top
Q6  38.73,13.65 0 top
R1  21.91,101.92 0 top
R2  22.54,96.2 180 top
R3  22.54,94.3 180 top
R4  22.54,89.22 180 top
R5  34.29,88.27 180 top
R6  58.42,88.27 180 top
R7  22.54,87.31 180 top
R8  39.69,84.77 270 top
R9  22.54,82.23 180 top
R10  22.54,80.33 180 top
R11  27.94,72.71 0 top
R12  51.44,67.31 90 top
R13  22.23,60.96 0 top
R14  47.62,60.96 0 top
R15  22.23,59.37 180 top
R16  47.62,59.37 180 top
R17  10.16,58.42 180 top
R18  34.29,58.42 180 top
R19  58.42,58.42 180 top
R20  15.88,53.98 90 top
R21  15.88,50.8 270 top
R22  18.73,48.26 90 top
R23  20.32,48.26 90 top
R24  43.5,48.26 90 top
R25  45.09,48.26 90 top
R26  46.67,48.26 90 top
R27  36.2,47.31 270 top
R28  40.32,42.55 270 top
R29  41.91,42.55 90 top
R30  43.5,42.55 90 top
R31  47.78,42.55 90 top
R32  49.37,42.55 90 top
R33  50.96,42.55 270 top
R34  19.37,41.91 270 top
R35  20.95,41.91 90 top
R36  22.54,41.91 90 top
R37  19.37,29.84 90 top
R38  20.95,29.84 270 top
R39  22.54,29.84 270 top
R40  40.96,29.84 90 top
R41  42.55,29.84 270 top
R42  44.13,29.84 270 top
R43  47.31,29.84 270 top
R44  48.9,29.84 270 top
R45  50.48,29.84 90 top
R46  53.98,29.84 90 top
R47  8.57,28.89 90 top
R48  10.16,28.89 90 top
R49  11.75,28.89 90 top
R50  29.21,13.97 90 top
R51  30.8,13.97 270 top
R52  41.27,13.97 90 top
R53  42.86,13.97 270 top
R54  10.16,13.65 0 top
R55  3.81,13.34 270 top
R56  20,13.34 270 top
R57  24.13,13.34 270 top
R58  36.2,13.34 270 top
R59  9.84,47.94 90 top
R60  65.09,21.59 90 top
SW1  28.89,103.19 0 top
SW2  39.69,103.19 180 top
SW3  10.16,95.25 90 top
SW4  10.16,81.28 90 top
U$3  [ROHS_BIG]  56.52,24.13 0 bottom
UC1  34.61,70.17 270 top

### Tracks (layer width: path | path; a pad name or v marks a point on that pad's centre or on a via)
+3V3  (via drill 0.6)
  Top 0.254: 32.38,105.09 SW1.B' 28.99,105.19 v28.89,105.09 28.8,105.19 SW1.B | C7.1 30.82,74.42 UC1.48 | 30.7,74.08 30.8,73.98 30.8,73.66 30.36,73.22 UC1.1 29,72.92 R11.2 | C4.1 38.84,74.4 v38.73,74.3 38.73,73.04 UC1.36 | v45.72,102.23 v28.89,102.23 | UC1.24 37.48,66.04 C14.1
  Top 0.406: v45.72,102.23 46.35,101.6 52.39,101.6 54.93,99.06 54.93,96.2 51.44,92.71 51.44,87.95 48.58,85.09 48.58,82.92 IC1.2 48.6,81.62 46.67,79.69 46.67,78.89 C1.+ 46.67,78.59 46.67,77.15 48.2,75.62 C6.1 v46.67,74.93 | v38.73,74.3 37.47,73.03 31.75,73.03 30.7,74.08 C7.1 | v35.88,68.9 38.73,66.04 C14.1
  Bottom 0.254: v28.89,102.23 v28.89,105.09 28.89,105.19
  Bottom 0.406: v45.72,102.23 JP2.1 | v46.67,74.93 45.4,73.66 39.37,73.66 v38.73,74.3 35.88,71.44 v35.88,68.9
+3V3_A  (via drill 0.6)
  Top 0.254: C12.1 28.06,68.92 UC1.9 33.36,68.92 35.56,71.12 v37.15,71.12 | C15.1 C16.1 44.87,65.72 45.4,65.72 45.7,66.02 IC4.1 45.7,68.24 46.35,68.9 46.99,68.9 48.58,70.48 v48.58,73.03 52.07,73.03 52.7,72.39 52.7,66.99 52.39,66.67 51.65,66.67 R12.1 | R6.P$1 60.96,81.31 | v5.4,32.38 7.94,29.84 8.47,29.84 R47.2 R48.2 R49.2 | R46.2 53.98,31.43 53.02,32.38 51.12,32.38 50.48,33.02 50.48,35.24 v49.53,36.2
  Top 0.305: v30.48,35.56 31.11,34.92 36.83,34.92 v37.47,35.56
  Top 0.406: IC3.2 9.84,72.66 9.84,71.44 10.48,70.8 13.97,70.8 14.75,71.58 C9.+ | 16.51,72.39 C5.1 | C9.+ 16.68,71.75 17,71.44 v20.64,71.44 | 16.51,72.39 C9.+ | 16.51,72.39 15.88,72.39 13.02,75.25 3.49,75.25 | v45.72,35.24 IC9.4 C33.1 | IC8.8 18.41,37.15 17.88,36.62 C30.1 16.83,35.56 v15.56,34.29 | v24.77,67.31 26.25,68.8 C11.1 C12.1 | R6.P$1 60.92,82.27 59.05,84.14 59.05,89.22 56.52,91.76 56.52,99.69 52.39,103.82 9.84,103.82 4.76,98.74 4.76,81.92 3.49,80.64 3.49,75.25 | v1.91,32.38 1.91,51.44 2.86,52.39 2.86,61.91 1.91,62.87 1.91,73.66 3.49,75.25
  Bottom 0.254: v48.58,73.03 39.05,73.03 v37.15,71.12 | v49.53,36.2 46.67,36.2 v45.72,35.24
  Bottom 0.305: v37.47,35.56 37.78,35.24 v45.72,35.24
  Bottom 0.406: v20.64,71.44 v24.77,67.31 | v30.48,35.56 29.21,34.29 v15.56,34.29 13.02,31.75 6.03,31.75 v5.4,32.38 v1.91,32.38
AREF_2.5
  Top 0.254: IC4.2 46.35,67.94 46.57,68.16 C13.1 | C13.1 IC2.1 | C13.1 R12.2
AREF_-10  (via drill 0.6)
  Top 0.254: C26.1 R27.2 35.95,46.21 IC7.2 | R18.P$3 31.75,51.38 31.75,50.16 32.07,49.85 33.97,49.85 34.6,49.22 34.6,47.31 | IC7.2 | R35.2 20.95,43.5 21.27,43.81 v23.81,43.81 24.13,43.5 24.13,35.56 29.84,29.84 37.15,29.84 37.47,29.53 37.47,28.57 38.1,27.94 39.69,27.94 42.23,25.4 42.23,24.13 v41.91,23.81 | v45.4,23.81 47.31,23.81 48.26,24.77 48.26,26.67 47.31,27.62 R43.2 | v10.16,60.96 10.16,58.1 v7.62,55.56 | 34.6,47.31 IC7.2 | v31.75,44.45 31.75,46.99 32.07,47.31 34.6,47.31 | v10.48,77.47 10.48,85.41 15.88,90.81 15.88,95.89 18.41,98.42 20.64,98.42 21.59,97.47 24.13,97.47 25.08,96.52 25.08,95.25 27.62,92.71 27.62,85.94 31.79,81.77 R5.P$3 | R59.3 8.57,47.94 | 8.57,47.94 R59.2 12.38,45.4 v17.46,45.4 | R17.P$3 7.62,51.38 7.62,50.16 8.57,49.21 8.57,47.94
  Bottom 0.254: v31.75,44.45 24.45,44.45 v23.81,43.81 19.05,43.81 v17.46,45.4 | v41.91,23.81 v45.4,23.81 | v10.48,77.47 9.21,76.2 9.21,72.39 11.75,69.85 11.75,68.58 10.16,66.99 v10.16,60.96 | v7.62,55.56 6.99,54.93 6.99,52.09 R17.P$3 | R19.P$3 55.88,51.46 55.88,52.7 55.24,53.34 48.74,53.34 48.42,53.02 46.83,53.02 46.51,53.34 32.54,53.34 31.79,52.59 R18.P$3
ASYM_ADC
  Top 0.254: UC1.18 34.36,62.93 32.7,61.28 32.7,57.15 30.8,55.24 30.16,55.24 28.57,53.66 28.57,46.99 26.67,45.09 26.67,36.83 31.11,32.38 36.51,32.38 40.32,36.2 40.32,37.47 | R28.1 40.22,43.5 39.69,43.5 39.37,43.18 39.37,38.73 39.74,38.36 C29.2 40.32,37.47 | IC9.14 41.91,37.78 41.59,37.47 40.32,37.47
ATTENUVERTER_ADC  (via drill 0.6)
  Top 0.254: R6.P$2 58.42,88.9 55.88,91.44 55.88,99.38 52.07,103.19 10.16,103.19 5.4,98.42 5.4,81.6 4.76,80.96 v4.76,79.69 | v8.57,69.22 9.53,68.26 11.75,68.26 12.7,67.31 12.7,66.04 14.61,64.14 18.1,64.14 20,62.23 27.3,62.23 29.84,64.77 29.84,66.99 30.27,67.42 UC1.12
  Bottom 0.254: v4.76,79.69 5.4,79.06 5.4,77.79 6.35,76.83 6.35,69.85 6.99,69.22 v8.57,69.22
BI  (via drill 0.6)
  Top 0.254: IC4.3 46.99,63.82 45.72,62.55 39.37,62.55 v38.1,63.82 | R13.2 26.99,60.96 30.8,64.77 v30.8,65.72
  Bottom 0.254: v30.8,65.72 32.07,66.99 36.2,66.99 38.1,65.09 v38.1,63.82
BI_OUT
  Top 0.254: IC5.1 18.41,50.16 18.73,49.85 R22.2 18.73,49 R23.1
BOOT_FLASH  (via drill 0.6)
  Top 0.254: 26.35,101.19 SW1.A | 26.35,101.19 SW1.A' | SW1.A 25.4,101.09 | v33.34,76.99 33.86,76.47 UC1.44 | 26.35,101.19 26.35,95.89 28.89,93.34 28.89,92.71 32.07,89.53 32.07,86.36 34.61,83.82 v35.56,83.82 | R1.2 23.81,101.92 24.54,101.19 SW1.A
  Bottom 0.254: v33.34,76.99 36.04,79.69 37.78,79.69 38.42,80.33 38.42,82.55 37.15,83.82 v35.56,83.82
CLOCK  (via drill 0.6)
  Top 0.254: Q3.C 13.97,16.19 12.06,18.1 9.84,18.1 8.26,19.68 8.26,25.72 9.53,26.99 9.84,26.99 10.16,27.3 R48.1 10.16,28.57 9.84,28.89 7.3,28.89 4.13,32.07 4.13,35.24 v5.08,36.2 | UC1.21 35.86,62.53 33.97,60.64 33.97,56.52 31.43,53.98 30.8,53.98 29.84,53.02 29.84,46.35 27.94,44.45 27.94,41.59 v28.26,41.27
  Bottom 0.254: v28.26,41.27 27.94,40.96 27.94,37.15 27.3,36.51 12.7,36.51 11.75,37.47 7.94,37.47 6.99,36.51 5.4,36.51 v5.08,36.2
CYCLE_SW  (via drill 0.6)
  Top 0.254: SW3.A2 SW3.A1 6.03,91.12 v6.03,80.64 | UC1.10 29.37,68.42 28.89,67.94 28.89,65.41 26.67,63.18 20.64,63.18 18.73,65.09 15.24,65.09 13.65,66.67 13.65,68.26 11.75,70.17 v7.62,70.17
  Bottom 0.254: v7.62,70.17 6.99,70.8 6.99,77.15 6.03,78.11 v6.03,80.64
DAC_MOSI
  Top 0.254: IC4.7 46.35,71.12 46.04,70.8 45.4,70.8 43.52,68.92 UC1.28
DAC_SCK
  Top 0.254: IC4.6 46.99,70.8 46.35,70.17 45.72,70.17 43.47,67.92 UC1.26
DAC_SS
  Top 0.254: IC4.5 47.62,71.91 47.62,70.48 46.67,69.53 46.04,69.53 43.92,67.42 UC1.25
EOA_OUT  (via drill 0.6)
  Top 0.254: UC1.33 40.14,71.42 42.55,73.82 42.55,74.93 v42.86,75.25 | v51.44,74.93 53.34,73.03 53.34,67.31 56.83,63.82 56.83,55.56 58.74,53.66 62.23,53.66 63.18,52.7 63.18,26.35 60.01,23.18 56.83,23.18 55.88,22.23 55.88,19.05 54.93,18.1 50.16,18.1 49.53,18.73 45.09,18.73 42.86,16.51 31.43,16.51 30.8,15.88 25.08,15.88 24.13,14.92 R57.1
  Bottom 0.254: v51.44,74.93 49.21,74.93 47.62,76.52 44.13,76.52 v42.86,75.25
EOD_OUT  (via drill 0.6)
  Top 0.254: UC1.32 40.44,70.92 43.81,74.3 43.81,75.88 v42.86,76.83 | v53.02,75.25 53.02,74.3 53.98,73.34 53.98,67.63 57.47,64.14 57.47,55.88 59.05,54.29 62.55,54.29 63.82,53.02 63.82,23.18 59.69,19.05 57.47,19.05 55.88,17.46 49.85,17.46 49.21,18.1 45.4,18.1 43.18,15.88 38.1,15.88 37.78,15.56 37.78,14.61 37.47,14.29 36.3,14.29 R58.1
  Bottom 0.254: v53.02,75.25 52.39,75.88 49.21,75.88 47.62,77.47 43.5,77.47 v42.86,76.83
F_CV
  Top 0.254: R23.2 20.32,49.53 19.68,50.16 IC5.2 19.68,52.7 19.05,53.34 16.09,53.34 R20.1 R21.1
FM_ADC
  Top 0.254: IC8.7 19.68,39.69 19.37,40.01 17.14,40.01 16.83,40.32 16.83,42.55 17.04,42.76 C27.2 R34.1 19.37,44.13 19.68,44.45 22.23,44.45 26.04,48.26 26.04,54.93 26.99,55.88 26.99,59.05 32.36,64.42 UC1.14
FREEZE  (via drill 0.6)
  Top 0.254: Q4.C 17.46,15.56 16.19,16.83 14.29,16.83 12.06,19.05 12.06,26.35 11.75,26.67 R49.1 11.85,27.94 12.38,27.94 12.7,28.26 12.7,30.48 12.06,31.11 7.94,31.11 5.4,33.66 5.4,34.29 v5.08,34.61 | UC1.19 34.86,62.48 33.34,60.96 33.34,56.83 31.11,54.61 30.48,54.61 29.21,53.34 29.21,46.67 27.3,44.77 27.3,37.78 28.26,36.83 v28.89,36.83
  Bottom 0.254: v28.89,36.83 27.94,35.88 12.38,35.88 11.43,34.92 8.26,34.92 7.3,35.88 6.35,35.88 v5.08,34.61
GND  (via drill 0.6)
  Top 0.254: C4.2 40.64,75.46 40.64,73.5 39.56,72.42 UC1.35 | v32.38,70.48 32.38,69.85 31.95,69.42 UC1.8 | C7.2 28.89,74.4 28.89,75.25 29.37,75.72 31.75,75.72 32.36,75.12 UC1.47 | UC1.20 35.36,67.11 | 36.86,66.97 UC1.23 36.86,65.06 37.15,64.77 40.01,64.77 40.64,65.41 40.64,65.94 C14.2
  other vias: 49.85,56.2 51.75,71.12 17.46,62.55 41.59,64.45 40.64,77.15 26.04,76.2 27.3,65.56 14.61,67.31 13.97,72.39 50.48,76.83 55.88,74.3 45.72,85.41 39.69,105.09 21.91,100.33 24.77,56.2 49.85,47.62 15.88,40.01 47.31,35.24 45.72,41.27 36.83,44.77 34.29,68.26 41.27,60.96 49.53,64.77 16.51,77.47 3.49,63.5 38.73,49.85 24.45,52.39 40.96,56.2 23.81,33.02 40.96,52.07 7.62,87.63 5.08,105.41 15.24,105.41 55.88,105.41 64.77,105.41 1.27,101.6 1.27,91.44 1.27,81.28 1.27,60.96 1.27,25.4 1.27,15.24 1.27,5.08 5.08,1.27 15.24,1.27 26.67,1.27 40.64,1.27 50.8,1.27 64.77,1.27 67.94,5.08 67.94,15.24 67.94,25.4 67.94,35.56 67.94,45.72 67.94,54.61 67.94,101.6 67.94,91.44 37.47,62.55 44.13,71.44 49.85,52.07 45.72,87 47.31,87 48.9,87 45.72,80.64 45.72,88.58 47.31,85.41 5.08,73.98 5.08,76.52 5.71,10.16
  pour Bottom: 0,106.68 0,0 69.22,0 69.22,106.68
  pour Top (isolate 0.203): 0,106.68 0,0 69.22,0 69.22,106.68
JTCK  (via drill 0.6)
  Top 0.254: v46.99,94.61 46.67,94.93 44.45,94.93 42.23,92.71 42.23,82.23 37.36,77.36 UC1.37
  Bottom 0.254: v46.99,94.61 JP2.4
JTDI
  Top 0.254: JP2.8 49.53,96.84 48.26,95.57 44.13,95.57 41.59,93.03 41.59,82.55 36.86,77.81 UC1.38
JTDO
  Top 0.254: JP2.6 48.26,96.84 47.62,96.2 43.81,96.2 40.96,93.34 40.96,82.87 36.36,78.27 UC1.39
JTMS  (via drill 0.6)
  Top 0.254: v45.72,93.98 45.4,94.3 44.77,94.3 42.86,92.39 42.86,78.11 41.91,77.15 41.91,73.98 39.85,71.92 UC1.34
  Bottom 0.254: v45.72,93.98 JP2.2
LEVEL_ADC
  Top 0.254: R45.1 C34.2 52.81,29 53.02,29.21 53.02,31.43 52.7,31.75 50.8,31.75 49.75,32.8 IC9.7 49.53,34.61 47.31,36.83 42.86,36.83 37.15,31.11 30.48,31.11 25.4,36.2 25.4,45.72 27.3,47.62 27.3,54.29 29.53,56.52 30.16,56.52 31.43,57.78 31.43,61.91 33.36,63.84 UC1.16
N$1  (via drill 0.6)
  Top 0.254: R42.2 44.13,28.26 43.81,27.94 43.81,19.37 42.55,18.1 41.27,18.1 35.88,23.5 29.53,23.5 26.35,26.67 14.61,26.67 13.34,27.94 13.34,31.11 12.7,31.75 8.26,31.75 6.03,33.97 6.03,42.55 v5.71,42.86
  Bottom 0.254: v5.71,42.86 6.67,43.81 J1.P3
N$2
  Top 0.254: C32.1 39.37,30.8 39.47,30.7 R40.2 R41.1 | R41.1 R42.1 | IC9.2 43.18,31.75 42.55,31.11 R41.1
N$3
  Top 0.254: R17.P$2 10.16,52.39 9.53,53.02 6.35,53.02 5.08,51.75 5.08,44.77 6.67,43.18 6.67,34.29 8.57,32.38 13.02,32.38 13.97,31.43 13.97,28.26 14.92,27.3 26.67,27.3 29.84,24.13 36.2,24.13 41.59,18.73 42.23,18.73 43.18,19.68 43.18,27.3 42.55,27.94 R41.2
N$4
  Top 0.254: R29.2 41.91,44.13 41.59,44.45 39.05,44.45 38.42,43.81 J2.P3
N$5
  Top 0.254: C29.1 | C29.1 R28.2 R29.1 R30.1 43.5,40.64 43.18,40.32 IC9.13
N$6
  Top 0.254: R46.1 53.98,28.26 55.24,26.99 55.24,19.37 54.61,18.73 50.48,18.73 49.53,19.68 J7.P2
N$7
  Top 0.254: UC1.5 24.33,70.92 22.23,73.03 Q1.2 22.23,77.47 22.54,77.79 C2.2
N$8
  Top 0.254: UC1.6 23.43,70.42 22.23,69.22 Q1.1 22.23,64.77 22.54,64.45 C17.2
N$9
  Top 0.254: R30.2 43.5,44.13 42.55,45.09 41.91,45.09 40.01,46.99 40.01,51.12 38.1,53.02 34.92,53.02 34.29,52.39 R18.P$2
N$10
  Top 0.254: R32.2 49.37,44.13 49.69,44.45 55.88,44.45 56.52,43.81 J3.P3
N$11
  Top 0.254: C28.1 R33.2 R32.1 R31.1 47.78,40.8 48.26,40.32 IC9.9
N$12
  Top 0.254: R31.2 47.78,44.13 49.37,45.72 60.64,45.72 60.96,45.4 62.23,45.4 62.55,45.72 62.55,52.39 61.91,53.02 59.05,53.02 58.42,52.39 R19.P$2
N$13  (via drill 0.6)
  Top 0.254: R44.2 48.9,28.26 50.8,26.35 52.39,26.35 53.66,25.08 v53.66,23.5
  Bottom 0.254: v53.66,23.5 55.56,25.4 J8.P3
N$14
  Top 0.254: R43.1 R44.1 | R44.1 R45.2 C34.1 | IC9.6 48.26,31.75 48.9,31.11 R44.1
N$15
  Top 0.254: R39.2 25.93,29 29.53,25.4 J6.P3
N$16
  Top 0.254: C31.1 R37.2 | R37.2 R38.1 R39.1 | R37.2 19.37,31.75 19.68,32.07 IC8.2
N$17  (via drill 0.6)
  Top 0.254: R5.P$2 34.29,83.19 31.43,86.04 31.43,89.22 28.26,92.39 28.26,93.03 25.72,95.57 25.72,96.84 24.45,98.11 21.91,98.11 20.95,99.06 18.1,99.06 15.24,96.2 15.24,91.12 9.84,85.72 9.84,78.42 8.57,77.15 v8.57,76.83 | R38.2 20.95,28.26 20.64,27.94 15.24,27.94 14.61,28.57 14.61,31.75 11.43,34.92 9.21,34.92 7.3,36.83 7.3,43.5 6.03,44.77 v6.03,49.85 | v9.21,60.01 9.21,58.42 v6.03,55.24
  Bottom 0.254: v8.57,76.83 8.57,72.07 11.11,69.53 11.11,68.9 9.53,67.31 9.53,61.91 9.21,61.59 v9.21,60.01 | v6.03,49.85 6.03,52.39 6.35,52.7 6.35,54.93 v6.03,55.24
N$18
  Top 0.254: R22.1 15.03,47.41 14.29,46.67 12.06,46.67 11.43,47.31 11.43,48.58 12.06,49.21 13.65,49.21 14.61,50.16 14.61,52.7 13.02,54.29 6.03,54.29 2.86,51.12 2.86,31.43 3.49,30.8 3.49,15.56 2.54,14.61 2.54,5.71 5.08,3.17 52.39,3.17 53.66,1.91 J13.P3
N$19
  Top 0.254: R5.P$1 36.83,81.31 36.83,82.23 38.52,83.92 R8.2
N$20
  Top 0.254: R36.2 23.28,42.76 23.5,42.55 23.5,35.24 29.53,29.21 36.51,29.21 36.83,28.89 36.83,28.26 37.78,27.3 39.37,27.3 40.96,25.72 40.96,23.18 41.91,22.23 J7.P3
N$21
  Top 0.254: R56.1 20,21.91 22.23,24.13 J5.P3
N$22
  Top 0.254: R35.1 IC8.6 | R35.1 R34.2 C27.1 | R35.1 R36.1
N$23
  Top 0.254: Q4.B 16.51,11.43 16.83,11.11 19.37,11.11 20,11.75 R56.2
N$24
  Top 0.254: R54.1 9.21,13.55 9.21,11.43 5.71,7.94 J9.P3
N$25
  Top 0.254: R54.2 11.75,13.65 12.06,13.34 12.06,12.7 12.21,12.55 Q3.B
N$26
  Top 0.254: R58.2 36.26,12.55 Q6.B
N$27  (via drill 0.6)
  Top 0.254: R53.1 R52.2 38.8,14.82 Q6.C 38.73,6.35 v38.1,5.71
  Bottom 0.254: v38.1,5.71 38.1,3.17 36.83,1.91 J11.P3
N$28
  Top 0.254: LED3.3 20.73,80.33 R10.2
N$29
  Top 0.254: LED3.1 20.73,82.23 R9.2
N$30
  Top 0.254: LED2.3 20.73,87.31 R7.2
N$31
  Top 0.254: LED2.1 20.73,89.22 R4.2
N$32
  Top 0.254: LED1.3 20.73,94.3 R3.2
N$33
  Top 0.254: LED1.1 20.73,96.2 R2.2
N$34
  Top 0.254: R10.1 25.4,80.33 29.05,76.68 31.59,76.68 32.86,75.41 UC1.46
N$35
  Top 0.254: R9.1 24.45,82.23 29.37,77.31 31.75,77.31 33.36,75.7 UC1.45
N$36
  Top 0.254: R7.1 24.13,87.31 25.08,86.36 25.08,82.55 29.69,77.95 33.97,77.95 34.36,77.56 UC1.43
N$37
  Top 0.254: R4.1 24.13,89.22 25.72,87.63 25.72,82.87 30,78.58 34.45,78.58 34.86,78.17 UC1.42
N$38
  Top 0.254: R3.1 24.13,94.3 26.35,92.08 26.35,83.19 30.32,79.22 34.77,79.22 35.36,78.62 UC1.41
N$39
  Top 0.254: R2.1 24.13,96.2 24.45,95.89 24.45,94.93 26.99,92.39 26.99,83.5 30.64,79.85 35.08,79.85 35.86,79.08 UC1.40
N$40
  Top 0.254: R59.1 14.61,47.94 15.88,49.21 R21.2
N$41
  Top 0.254: IC6.2 R25.2 R26.2
N$42
  Top 0.254: IC5.7 C19.2 | IC5.7 IC5.6 | IC5.7 19.68,55.24 19.27,54.83 R20.2
N$43
  Top 0.254: R15.1 22.96,59.48 | IC5.5 22.23,57.78 23.07,58.63 R15.1 | R15.1 23.18,59.27 C22.1
N$44  (via drill 0.6)
  Top 0.254: R51.1 R50.2 26.74,14.82 Q5.C 26.67,6.67 v24.77,4.76
  Bottom 0.254: v24.77,4.76 24.77,3.17 23.5,1.91 J10.P3
N$45
  Top 0.254: R15.2 21.27,59.48 21.38,59.58 R13.1 21.27,60.86 C19.1 19.68,60.64 20.11,61.06
N$46
  Top 0.254: IC6.1 43.81,50.16 43.5,49.85 R24.2 43.5,49 R25.1
N$47
  Top 0.254: R57.2 24.2,12.55 Q5.B
N$48
  Top 0.254: J8.P2 62.55,17.78 63.5,18.73 63.5,21.91 64.13,22.54 R60.2
N$56
  Top 0.406: JP1.2 JP1.1 66.67,79.69 66.04,80.33 D1.A
N$57
  Top 0.254: R55.1 3.81,14.92 5.71,16.83 J4.P3
N$64
  Top 0.406: JP1.10 JP1.9 66.67,65.09 66.04,64.45 D2.C
N$66
  Top 0.254: R55.2 3.88,12.55 Q2.B
N$67
  Top 0.254: C21.2 IC6.7 IC6.6 IC6.3
N$69
  Top 0.254: R16.1 48.36,59.48 | R16.1 48.58,59.27 C23.1 | IC6.5 47.62,57.78 48.48,58.63 R16.1
N$71
  Top 0.254: R16.2 46.67,59.48 46.77,59.58 R14.1 46.67,60.86 C21.1 45.29,61.06
PROC_ADC
  Top 0.254: 49.53,37.47 IC9.8 | 49.53,37.47 42.55,37.47 36.83,31.75 30.8,31.75 26.04,36.51 26.04,45.4 27.94,47.31 27.94,53.98 29.84,55.88 30.48,55.88 32.07,57.47 32.07,61.59 33.86,63.38 UC1.17 | 49.53,37.47 50.64,37.47 50.96,37.78 C28.2 51.7,38.36 51.91,38.58 51.91,43.02 51.59,43.34 51.02,43.34 R33.1
RANGE_SW  (via drill 0.6)
  Top 0.254: SW4.A1 SW4.A2 | UC1.11 29.66,67.92 29.37,67.63 29.37,65.09 26.99,62.71 20.32,62.71 18.41,64.61 14.92,64.61 13.18,66.36 13.18,67.79 11.75,69.22 v10,69.22
  Bottom 0.254: v10,69.22 8.89,70.33 7.66,71.56 SW4.A1
RESET  (via drill 0.6)
  Top 0.254: v53.66,97.16 53.66,99.38 52.07,100.97 43.81,100.97 43.59,101.19 SW2.B v38.73,101.19 SW2.B' | v25.08,72.71 R11.1 27.3,72.92 v27.3,74.93 | v25.08,69.53 25.47,69.92 UC1.7 | v36.51,86.36 36.51,91.12 v40.64,95.25
  Bottom 0.254: v53.66,97.16 JP2.10 | v25.08,69.53 v25.08,72.71 | v27.3,74.93 27.94,74.3 34.61,74.3 40.01,79.69 40.01,82.87 v36.51,86.36 | v40.64,95.25 41.59,95.25 43.18,96.84 43.18,99.06 41.05,101.19 v38.73,101.19
RX
  Top 0.254: UC1.31 40.73,70.42 44.45,74.14 44.45,76.2 43.81,76.83 43.81,77.15 43.5,77.47 43.5,91.76 44.77,93.03 49.85,93.03 52.07,95.25 52.07,98.74 51.12,99.69 45.72,99.69 42.23,96.2 36.2,96.2 35.56,96.84 JP3.4
SHAPE_ADC
  Top 0.254: R40.1 C32.2 38.31,29 38.1,29.21 38.1,30.48 | 38.1,30.48 30.16,30.48 24.77,35.88 24.77,46.04 26.67,47.94 26.67,54.61 27.62,55.56 27.62,58.9 32.86,64.13 UC1.15 | 38.1,30.48 38.1,31.11 39.79,32.8 IC9.1
START  (via drill 0.6)
  Top 0.254: Q2.C 6.35,19.37 7.3,20.32 7.3,25.72 8.57,26.99 R47.1 7.2,28.04 3.49,31.75 3.49,40.64 v3.81,40.96 | UC1.22 36.36,62.08 34.61,60.33 34.61,56.2 31.75,53.34 31.11,53.34 30.48,52.7 30.48,46.04 28.57,44.13 28.57,42.86 v28.89,42.55
  Bottom 0.254: v28.89,42.55 28.57,42.23 27.62,42.23 27.3,41.91 27.3,37.78 26.67,37.15 16.51,37.15 11.75,41.91 8.57,41.91 7.62,40.96 v3.81,40.96
TX
  Top 0.254: UC1.30 41.02,69.92 45.09,73.98 45.09,76.52 44.45,77.15 44.45,77.47 44.13,77.79 44.13,91.44 45.09,92.39 50.16,92.39 52.7,94.93 52.7,99.06 51.44,100.33 45.4,100.33 44.45,99.38 38.73,99.38 38.1,98.74 JP3.5
UNI
  Top 0.254: R14.2 48.58,61.06 48.58,62.87 47.65,63.8 IC4.4
UNI_OUT  (via drill 0.6)
  Top 0.254: v61.59,46.35 43.81,46.35 43.5,46.67 R24.1 | v66.04,46.35 66.04,25.4 67.63,23.81 67.63,20.32 60.64,13.34 45.72,13.34 41.91,9.53 J12.P3
  Bottom 0.254: v66.04,46.35 v61.59,46.35
VCC  (via drill 0.6)
  Top 0.254: R53.2 42.86,12.38 40.01,9.53 40.01,5.4 38.42,3.81 29.21,3.81 28.26,4.76 28.26,8.26 30.8,10.79 R51.2 | R60.1 | 49.21,14.29 49.53,13.97 60.33,13.97 65.09,18.73 65.09,20
  Top 0.305: v64.45,53.98 64.45,25.4 66.36,23.5 66.36,20.95 66.04,20.64 R60.1 | 49.21,14.29 45.09,14.29 43.92,13.12 R53.2 | R60.1 65.09,20 65.09,19.68
  Top 0.406: C3.+ 60.64,76.02 60.64,74.3 58.42,72.07 58.42,67.31 59.05,66.67 v59.05,57.15 | 50.91,82.87 IC1.3 50.89,82.14 54.93,78.11 59.37,78.11 60.01,77.47 60.01,76.2 C3.+ | 17.04,59.16 12.7,63.5 7.62,63.5 5.08,66.04 5.08,69.22 3.49,70.8 C8.+ 3.67,71.75 5.08,71.75 6.01,72.68 IC3.3 | 17.04,59.16 C18.1 18.1,58.1 18.41,57.78 IC5.8 | v17.14,56.2 17.04,56.3 17.04,59.16 | v42.55,55.24 42.55,58.74 42.86,59.05 43.4,59.05 C20.1 43.5,58.1 43.81,57.78 IC6.8 | D1.C 65.09,85.72 63.5,84.14 63.5,80.33 60.82,77.65 C3.+
  Bottom 0.305: v64.45,53.98 61.28,57.15 v59.05,57.15
  Bottom 0.406: 42.55,54.93 23.81,54.93 23.5,55.24 18.1,55.24 v17.14,56.2 | v59.05,57.15 56.83,54.93 48.26,54.93 48.1,55.09 47.15,55.09 46.99,54.93 42.55,54.93 | 42.55,54.93 v42.55,55.24
VEE  (via drill 0.6)
  Top 0.254: R27.1 36.2,48.9 v35.56,49.53
  Top 0.406: C25.2 48.26,49.85 47.62,50.48 IC6.4 v47.62,53.98 | IC5.4 22.23,50.16 21.91,49.85 C24.2 22.12,49.11 23.18,50.16 v23.18,53.98 | C10.- 60.47,68.58 60.33,68.44 v60.33,55.88 | C10.- 61.28,68.58 | D2.A 66.04,60.01 65.09,60.96 63.18,60.96 61.28,62.87 61.28,67.31 60.82,67.77 C10.-
  Bottom 0.254: v35.56,49.53 30.8,49.53 30.16,50.16 30.16,53.98
  Bottom 0.406: v23.18,53.98 30.16,53.98 v47.62,53.98 57.15,53.98 59.05,55.88 v60.33,55.88
VOCT_ADC
  Top 0.254: R37.1 C31.2 17.04,29 16.83,29.21 16.83,31.43 17.14,31.75 17.78,31.75 18.41,32.38 IC8.1 18.36,33.34 14.92,33.34 14.29,33.97 14.29,34.92 14.92,35.56 14.92,42.55 16.19,43.81 18.1,43.81 19.37,45.09 21.91,45.09 25.4,48.58 25.4,55.24 26.35,56.2 26.35,59.21 31.86,64.72 UC1.13

### Text on the board
tPlace: Tides
bPlace: Tides | Red stripe
tNames: SYSBOOT | RESET | Bipolar output | Offset adjust. | cc-by-sa Émilie Gillet, 2015. v4
bNames: FTDI dongle | mini JTAG | GND | RX< | TX> | JTMS | JTCK | JTDO | JTDI | RESET | +12V | GND | GND | GND | -12V | cc-by-sa Émilie Gillet, 2015. v4